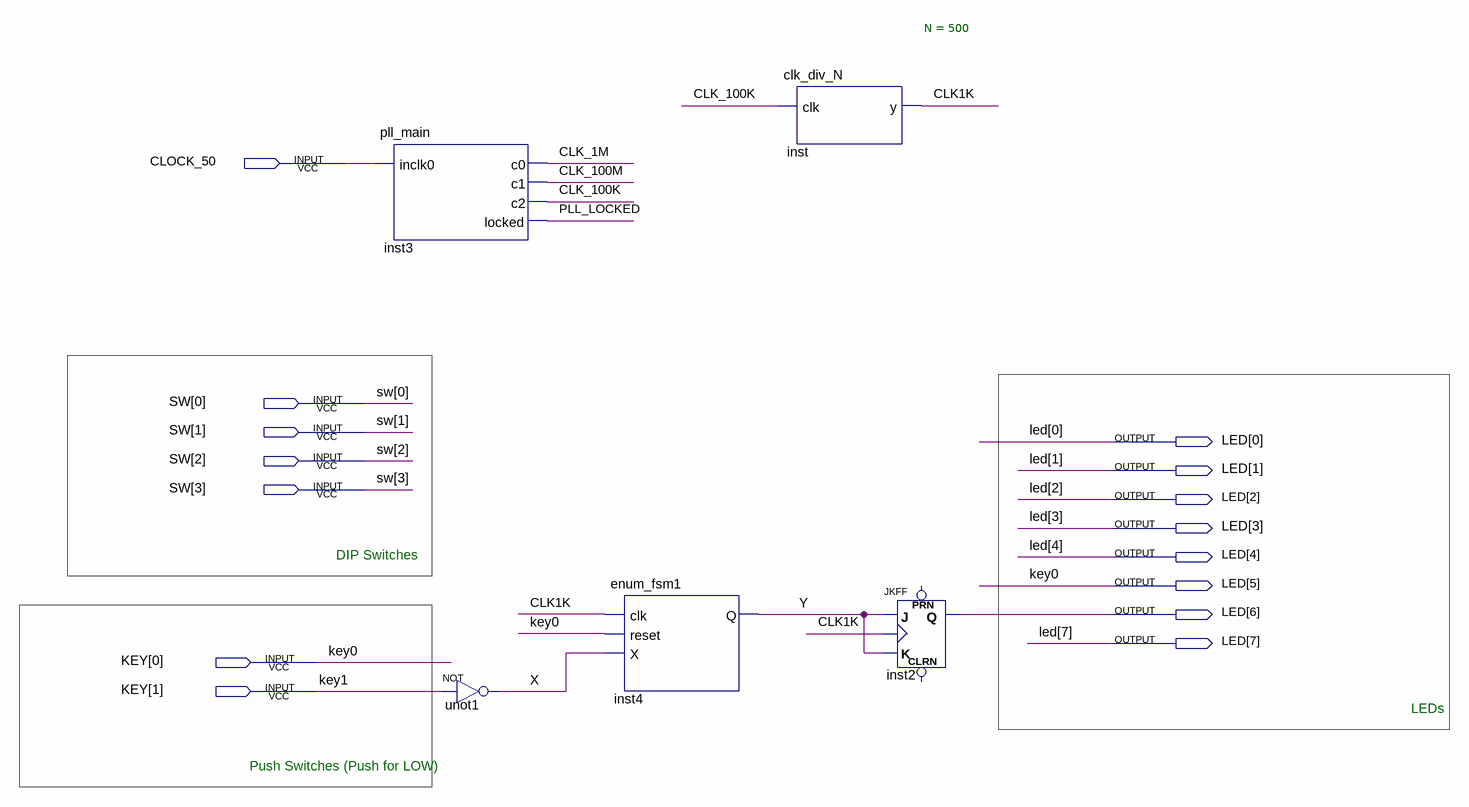
[diagram p0: schematic sheet]
// Quartus schematic TopLevelSchematic.bdf as structural Verilog: 5 symbols, 15 pins
module TopLevelSchematic (
  input  CLOCK_50,
  input  [3:0] SW,
  input  [1:0] KEY,
  output [7:0] LED
);

  wire CLK1K, CLK_1M, CLK_100K, CLK_100M, PLL_LOCKED, X, Y;

  pll_main inst3 (.inclk0(CLOCK_50), .c0(CLK_1M), .c1(CLK_100M), .c2(CLK_100K), .locked(PLL_LOCKED));
  not unot1 (X, KEY[1]);
  enum_fsm1 inst4 (.clk(CLK1K), .reset(KEY[0]), .X(X), .Q(Y));
  clk_div_N #(.N(500)) inst (.clk(CLK_100K), .y(CLK1K));
  JKFF inst2 (.K(Y), .J(Y), .CLK(CLK1K), .Q(LED[6]));  // open: PRN, CLRN

  assign LED[5] = KEY[0];

  // Notes on the sheet:
  //   DIP Switches
  //   LEDs
  //   Push Switches (Push for LOW)
endmodule
